# EAGLE design GeigerCounter (EAGLE 6.3)
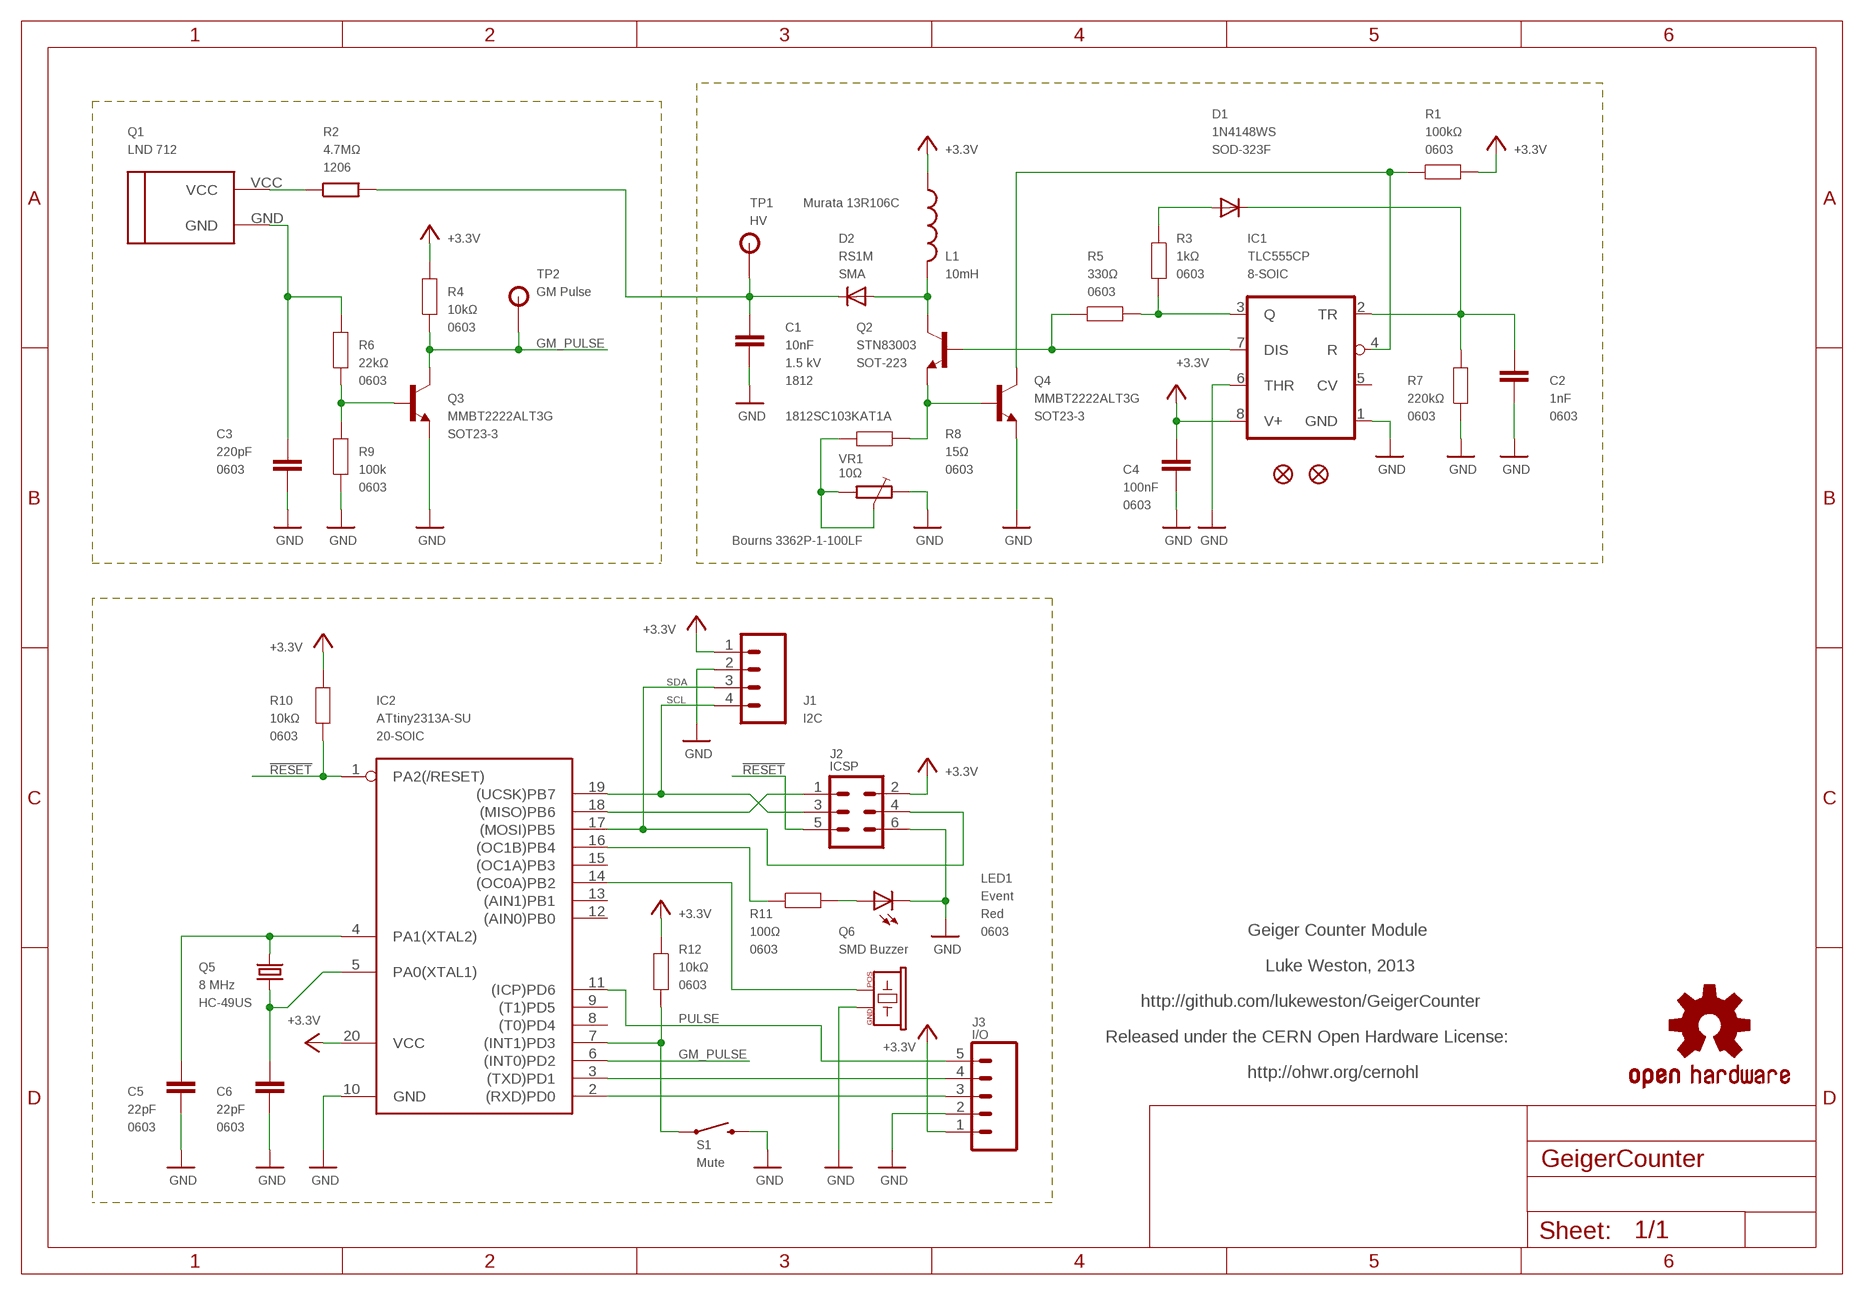
[diagram p0: schematic, sheet 1]

## Parts
C1  10nF  C-EUC1812  [C1812]
C2  1nF  CAP0603  [0603]
C3  220pF  CAP0603  [0603]
C4  100nF  CAP0603  [0603]
C5  22pF  CAP0603  [0603]
C6  22pF  CAP0603  [0603]
D1  1N4148WS  DIODESOD  [SOD-323]
D2  RS1M  DIODE-DO214AC  [DO214AC]
IC1  TLC555CP  LM555D  [SO08]
IC2  ATtiny2313A-SU  TINY2313-*S*  [SO20L$]
J1  I2C  M04PTH  [1X04]
J2  ICSP  ICSP-6  [ICSP-6]
J3  I/O  M05PTH  [1X05]
JP1  FIDUCIALUFIDUCIAL  [MICRO-FIDUCIAL]
JP2  FIDUCIALUFIDUCIAL  [MICRO-FIDUCIAL]
L1  10mH  INDUCTOR-5.08  [INDUCTOR-5.08]
LED1  Event  LED0603  [LED-0603]
Q1  LND 712  GEIGER_TUBELND712  [GEIGER_TUBE]
Q2  STN83003  -NPN-SOT223  [SOT223]
Q3  MMBT2222ALT3G  TRANSISTOR_NPNSOT23  [SOT23]
Q4  MMBT2222ALT3G  TRANSISTOR_NPNSOT23  [SOT23]
Q5  8 MHz  CRYSTALHC49US  [HC49US]
Q6  SMD Buzzer  BUZZERSMD12X12  [BUZZER-12X12-SMT]
R1  100kΩ  RESISTOR0603  [0603]
R2  4.7MΩ  R-EU_R1206  [R1206]
R3  1kΩ  RESISTOR0603  [0603]
R4  10kΩ  RESISTOR0603  [0603]
R5  330Ω  RESISTOR0603  [0603]
R6  22kΩ  RESISTOR0603  [0603]
R7  220kΩ  RESISTOR0603  [0603]
R8  15Ω  RESISTOR0603  [0603]
R9  100k  RESISTOR0603  [0603]
R10  10kΩ  RESISTOR0603  [0603]
R11  100Ω  RESISTOR0603  [0603]
R12  10kΩ  RESISTOR0603  [0603]
S1  Mute  SWITCH-MOMENTARY-2SMD  [TACTILE_SWITCH_SMD]
SY  OSHW-LOGOS  [OSHW-LOGO-S]
TP1  HV  TPPTH  [TP_PTH]
TP2  GM Pulse  TPPTH  [TP_PTH]
VR1  10Ω  TRIM_EU-CT6  [CT6]

## Nets
!RESET: IC2.1(PA2(/RESET)) J2.5 R10.1
+3V3: C4.1 IC1.8(V+) IC2.20(VCC) J1.1 J2.2 J3.1 L1.1 R1.1 R4.2 R10.2 R12.1 ; supply symbol labelled +3.3V
GM_PULSE: IC2.6((INT0)PD2) Q3.3(C) R4.1 TP2.P$1(TP)
GND: C1.2 C2.2 C3.2 C4.2 C5.2 C6.2 IC1.1(GND) IC1.6(THR) IC2.10(GND) J1.2 J2.6 J3.2 LED1.C Q3.2(E) Q4.2(E) Q6.1(GND) R7.1 R9.1 S1.3 VR1.E
MUTE1: IC2.7((INT1)PD3) R12.2 S1.1
N$1: Q1.VCC R2.1
N$14: IC1.7(DIS) Q2.1(B) R5.2
N$15: IC1.4(R) Q4.3(C) R1.2
N$26: IC2.2((RXD)PD0) J3.3
N$27: IC2.3((TXD)PD1) J3.4
N$28: C6.1 IC2.5(PA0(XTAL1)) Q5.1
N$29: C5.1 IC2.4(PA1(XTAL2)) Q5.2
N$31: IC2.18((MISO)PB6) J2.1
N$33: IC2.16((OC1B)PB4) R11.2
N$34: LED1.A R11.1
N$35: IC2.14((OC0A)PB2) Q6.2(POS)
N$39: IC1.3(Q) R3.2 R5.1
N$48: C3.1 Q1.GND R6.2
N$49: Q3.1(B) R6.1 R9.2
N$50: C2.1 D1.1(C) IC1.2(TR) R7.2
N$54: D1.2(A) R3.1
N$55: Q2.3(E) Q4.1(B) R8.2
N$56: R8.1 VR1.A VR1.S
N$57: D2.A L1.2 Q2.4(C)
N$58: C1.1 D2.C R2.2 TP1.P$1(TP)
PULSE: IC2.11((ICP)PD6) J3.5
SCL: IC2.19((UCSK)PB7) J1.4 J2.3
SDA: IC2.17((MOSI)PB5) J1.3 J2.4
Unconnected: IC1.5(CV) IC2.8((T0)PD4) IC2.9((T1)PD5) IC2.12((AIN0)PB0) IC2.13((AIN1)PB1) IC2.15((OC1A)PB3)

## Notes on the sheet
- Geiger Counter Module
- Luke Weston, 2013
- http://github.com/lukeweston/GeigerCounter
- Released under the CERN Open Hardware License:
- http://ohwr.org/cernohl

## Library data of the parts
C1 = rcl:C-EU: CAPACITOR, European symbol; ID: 1812SC103KAT1A; PACKAGE: 1812; VOLTAGE: 1.5 kV
C2-C6 = freetronics-master-v1:CAP: Capacitor Standard 0603 ceramic capacitor, and 0.1" leaded capacitor.; PACKAGE: 0603
D1 = SparkFun:DIODE: Diode These are standard reverse protection diodes and small signal diodes. SMA package can handle up to about 1A. SOD-323 can handle about 200mA. What the SOD-323 package when ordering, there are some mfgs out there that are 5-pin packages.; PACKAGE: SOD-323F
D2 = diode:DIODE-: DIODE; PACKAGE: SMA
IC1 = linear:*555: TIMER; PACKAGE: 8-SOIC
IC2 = avr-6:TINY2313*: Atmel Tiny2313 2K Flash, 128 bytes EEPROM, 128 bytes RAM; PACKAGE: 20-SOIC
J1 = freetronics-master-v1:M04: Header 4 Standard 4-pin 0.1" header. Use with straight break away headers (SKU : PRT-00116), right angle break away headers (PRT-00553), swiss pins (PRT-00743), machine pins (PRT-00117), and female headers (PRT-00115). Molex polarized connector foot print use with SKU : PRT-08231 with associated crimp pins and housings.
J2 = connectors:ICSP-6: PIN HEADER
J3 = freetronics-master-v1:M05: Header 5 Standard 5-pin 0.1" header. Use with straight break away headers (SKU : PRT-00116), right angle break away headers (PRT-00553), swiss pins (PRT-00743), machine pins (PRT-00117), and female headers (PRT-00115). Molex polarized connector foot print use with SKU : PRT-08230 with associated crimp pins and housings.
JP1 JP2 = SparkFun:FIDUCIAL: Fiducial Alignment Points Various fiducial points for machine vision alignment.
L1 = Luke:INDUCTOR-5.08; ID: Murata 13R106C
LED1 = freetronics-master-v1:LED: LEDs Standard schematic elements and footprints for 5mm, 3mm, 1206, and 0603 sized LEDs. 5mm - Spark Fun Electronics SKU : COM-00529 (and others); COLOR: Red; PACKAGE: 0603
Q1 = SparkFun:GEIGER_TUBE: LND712 Geiger Tube
Q2 = transistor-neu-to92:*-NPN-: NPN Transistror; PACKAGE: SOT-223
Q3 Q4 = SparkFun:TRANSISTOR_NPN: Transistor NPN BJT configuration in SOT23 package. MMBT2222 is the common NPN we use. Double check BCE configuration again layout.; PACKAGE: SOT23-3
Q5 = freetronics-master-v1:CRYSTAL: Crystals Various standard crystals. Proven footprints. Spark Fun Electronics SKU : COM-00534; PACKAGE: HC-49US
Q6 = freetronics-master-v1:BUZZER: Buzzer - Piezo Transducer
R1 R3-R12 = freetronics-master-v1:RESISTOR: Resistor Basic schematic elements and footprints for 0603, 1206, and PTH 1/10th watt (small) resistors.; PACKAGE: 0603
R2 = rcl:R-EU_: RESISTOR, European symbol; PACKAGE: 1206
S1 = SparkFun:SWITCH-MOMENTARY-2
SY = SparkFun:OSHW-LOGO: Open Source Hardware Logo This logo indicates the piece of hardware it is found on incorporates a OSHW license and/or adheres to the definition of open source hardware found here: http://freedomdefined.org/OSHW
TP1 TP2 = connectors:TP: Test Point JSK 1/14/11
VR1 = pot:TRIM_EU-: POTENTIOMETER; ID: Bourns 3362P-1-100LF

## Board
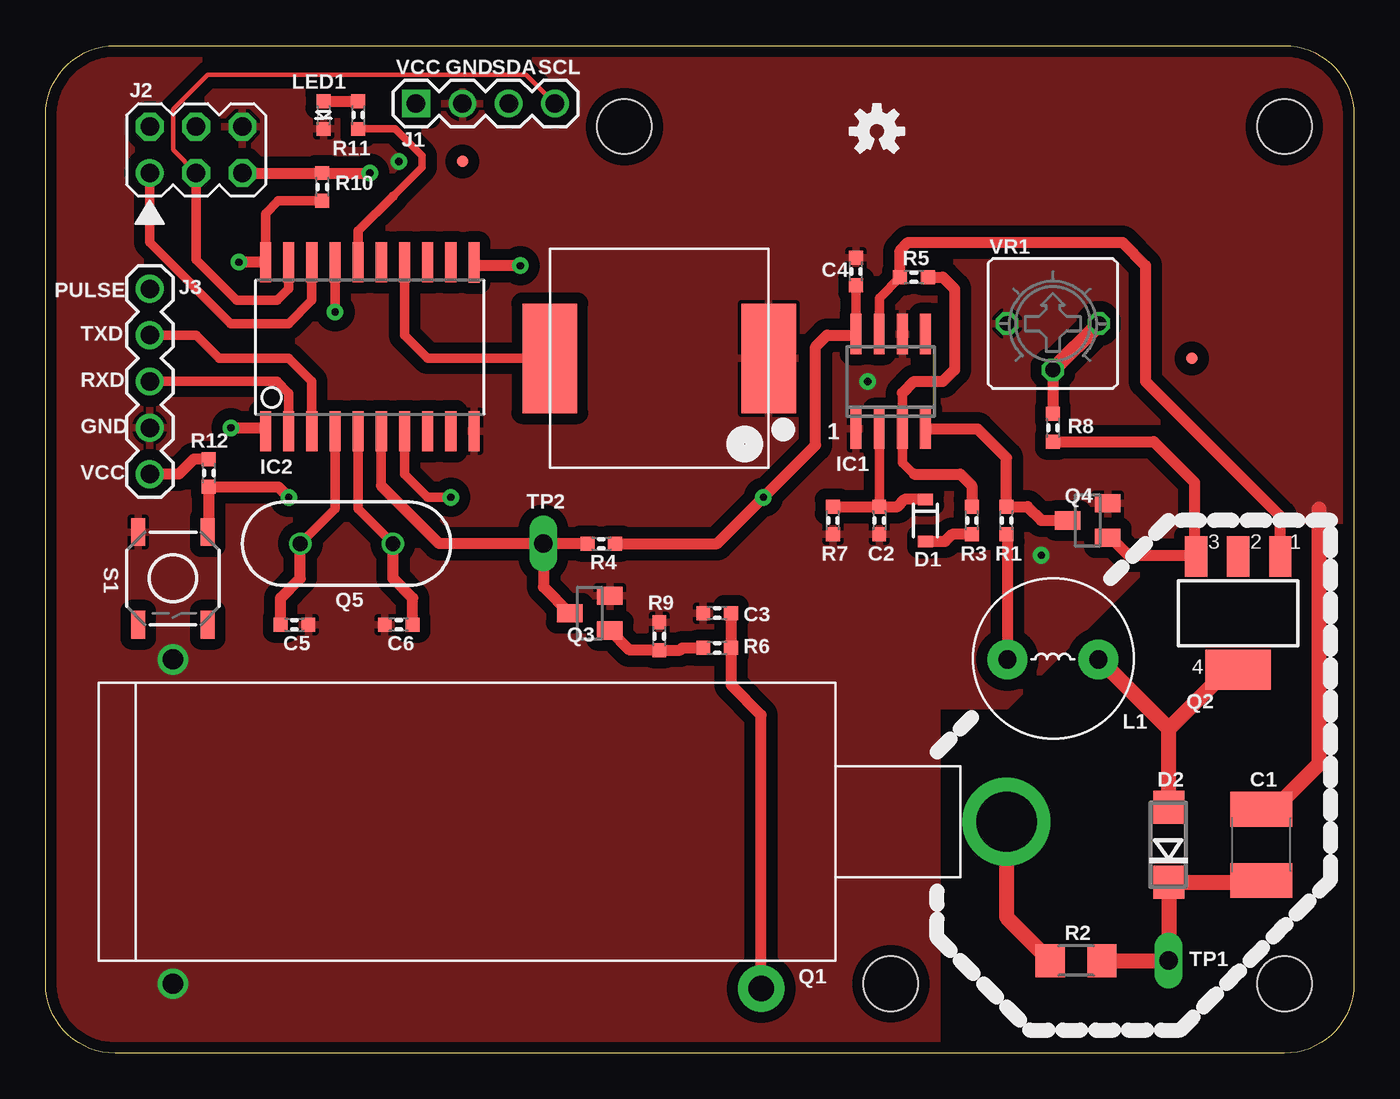
[diagram p1: board, top side]
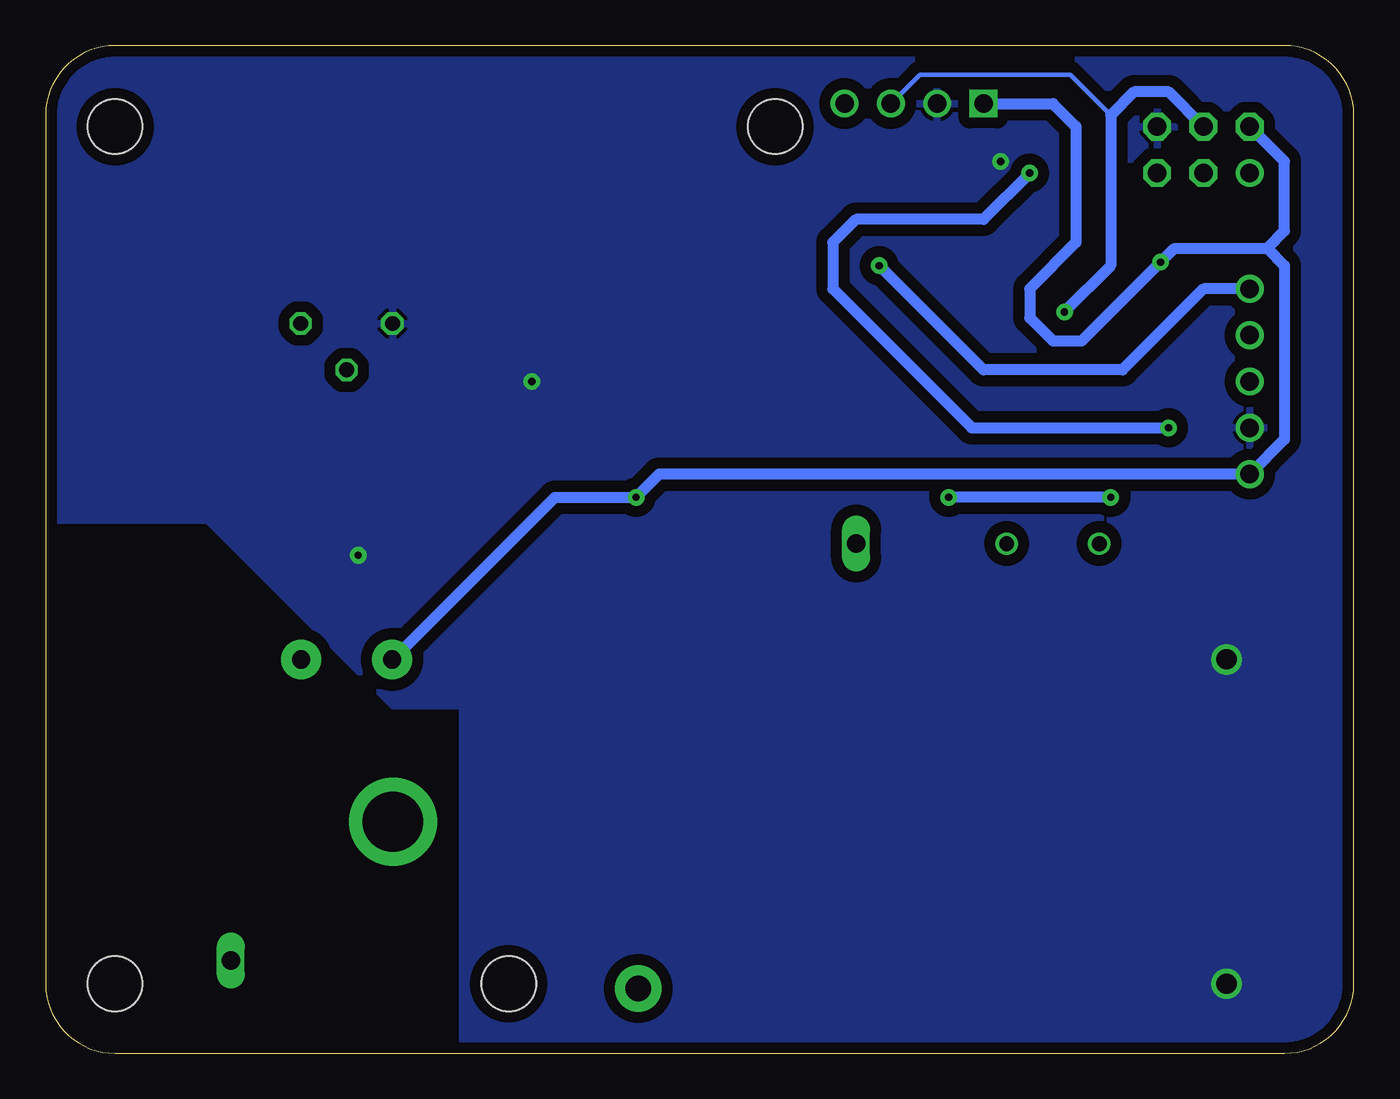
[diagram p2: board, bottom side, seen from below]

Size 71.76 x 55.24 mm. Coordinates in mm from the lower left corner, seen from the top.
Outline: 0,3.81 0,51.43 arc-90 3.81,55.24 67.95,55.24 arc-90 71.76,51.43 71.76,3.81 arc-90 67.95,0 3.81,0 arc-90 0,3.81
Copper layers (1*16): Top 0.035mm / dielectric 1.5mm / Bottom 0.035mm
Design rules "PCBCart-Standard *": minimum track width 8mil, minimum drill 0.4mm, track to track 8mil, track to pad 8mil, pad to pad 8mil, via to via 8mil, smd to smd 8mil, copper to edge 20mil, drill to drill 8mil, minimum pad ring 8mil, minimum via ring 10mil, stop-mask expansion 3mil, vias tented up to drill 16mil, thermal gap 8mil
Holes 3 mm at 46.35,3.81 31.75,50.8 67.95,50.8 67.95,3.81

### Footprints (pad centres in the part's own frame; a part is rotated, then mirrored left to right if it is on the bottom)
C1812 = smd 1.9 x 3.4: 1 -1.95,0; 2 1.95,0
0603 = smd 0.762 x 0.762: 1 -0.762,0; 2 0.762,0
SOD-323 = smd 0.63 x 0.83: 1 -1.15,0; 2 1.15,0
DO214AC = smd 1.8 x 1.7: A 2.05,0; C -2.05,0
SO08 = smd 0.6 x 2.2: 1 -1.905,-2.6; 2 -0.635,-2.6; 3 0.635,-2.6; 4 1.905,-2.6; 5 1.905,2.6; 6 0.635,2.6; 7 -0.635,2.6; 8 -1.905,2.6
SO20L$ = smd 0.61 x 2.21: 1 -5.715,-4.636; 2 -4.445,-4.636; 3 -3.175,-4.636; 4 -1.905,-4.636; 5 -0.635,-4.636; 6 0.635,-4.636; 7 1.905,-4.636; 8 3.175,-4.636; 9 4.445,-4.636; 10 5.715,-4.636; 11 5.715,4.61; 12 4.445,4.636; 13 3.175,4.636; 14 1.905,4.636; 15 0.635,4.636; 16 -0.635,4.636; 17 -1.905,4.636; 18 -3.175,4.636; 19 -4.445,4.636; 20 -5.715,4.636
1X04 = drill 1.016 square: 1 0,0 | drill 1.016: 2 2.54,0; 3 5.08,0; 4 7.62,0
ICSP-6 = drill 1.016: 1 -2.54,-1.27 | drill 1.016 octagon: 2 -2.54,1.27; 3 0,-1.27; 4 0,1.27; 5 2.54,-1.27; 6 2.54,1.27
1X05 = drill 1.016: 1 0,0; 2 2.54,0; 3 5.08,0; 4 7.62,0; 5 10.16,0
MICRO-FIDUCIAL = smd 0.635 x 0.635: 1 0,0
INDUCTOR-5.08 = drill 1 pad 2.184: 1 -2.5,0; 2 2.5,0
LED-0603 = smd 0.762 x 0.762: A -0.762,0; C 0.762,0
GEIGER_TUBE = drill 1.4 pad 2.54: GND 13.462,9.144 | drill 3.302 pad 4.826: VCC 0,0
SOT223 = smd 1.219 x 2.235: 1 -2.311,-3.099; 2 0,-3.099; 3 2.311,-3.099 | smd 3.6 x 2.2: 4 0,3.099
SOT23 = smd 1 x 1.4: 1 -0.95,-1.1; 2 0.95,-1.1; 3 0,1.1
HC49US = drill 0.813: 1 -2.54,0; 2 2.54,0
BUZZER-12X12-SMT = smd 3 x 6: 1 -6,0; 2 6,0
R1206 = smd 1.6 x 1.803: 1 -1.422,0; 2 1.422,0
TACTILE_SWITCH_SMD = smd 1.524 x 0.762: 1 -2.54,1.905; 2 2.54,1.905; 3 -2.54,-1.905; 4 2.54,-1.905
TP_PTH = drill 1.016 long: P$1 0,0
CT6 = drill 0.813 octagon: A 2.515,0; E -2.515,0; S 0,-2.54

### Placement (x,y rotation side)
C1  66.68,11.43 90 top
C2  45.72,29.21 270 top
C3  36.83,24.13 180 top
C4  44.45,42.86 90 top
C5  13.65,23.5 0 top
C6  19.37,23.5 180 top
D1  48.26,29.21 270 top
D2  61.59,11.43 90 top
IC1  46.35,36.83 0 top
IC2  17.78,38.73 0 top
J1  20.32,52.07 0 top
J2  8.26,49.53 0 top
J3  5.71,31.75 90 top
JP1  62.86,38.1 0 top
JP2  22.86,48.89 0 top
L1  55.24,21.59 0 top
LED1  15.24,51.43 270 top
Q1  52.7,12.7 180 top
Q2  65.41,24.13 180 top
Q3  29.85,24.13 90 top
Q4  57.15,29.21 90 top
Q5  16.51,27.94 180 top
Q6  33.66,38.1 180 top
R1  52.7,29.21 90 top
R2  56.52,5.08 0 top
R3  50.8,29.21 90 top
R4  30.48,27.94 0 top
R5  47.62,42.54 180 top
R6  36.83,22.23 0 top
R7  43.18,29.21 90 top
R8  55.24,34.29 270 top
R9  33.66,22.86 270 top
R10  15.18,47.5 270 top
R11  17.15,51.43 270 top
R12  8.95,31.81 270 top
S1  6.98,26.04 270 top
SY  45.59,50.55 0 top
TP1  61.59,5.08 90 top
TP2  27.31,27.94 90 top
VR1  55.24,40 0 top

### Tracks (layer width: path | path; a pad name or v marks a point on that pad's centre or on a via)
!RESET  (via drill 0.4)
  Top 0.406: 11.87,34.29 IC2.1
  Top 0.61: v17.78,48.26 R10.1 J2.5 | v10.16,34.29 11.87,34.29
  Bottom 0.61: v10.16,34.29 20.96,34.29 28.58,41.91 28.58,44.45 27.31,45.72 20.32,45.72 v17.78,48.26
+3V3  (via drill 0.4)
  Top 0.406: 52.74,28.41 R1.1 | 44.39,39.37 IC1.8
  Top 0.508: C4.1 IC1.8 | R10.2 12.76,46.74 12.06,46.04 IC2.20
  Top 0.61: R12.1 8.13,32.58 7.3,31.75 J3.1 | 44.39,39.37 42.86,39.37 42.23,38.73 42.23,33.34 v39.37,30.48 36.83,27.94 R4.2 | IC2.20 v10.61,43.37 | 52.74,28.41 L1.1
  Bottom 0.406: 51.43,22.86 51.48,22.86
  Bottom 0.61: J2.2 3.81,48.89 3.81,45.08 4.76,44.13 | 4.76,44.13 9.84,44.13 v10.61,43.37 14.92,39.05 16.51,39.05 17.78,40.32 17.78,41.91 15.24,44.45 15.24,50.8 16.51,52.07 J1.1 | 4.76,44.13 3.81,43.18 3.81,33.65 J3.1 38.1,31.75 v39.37,30.48 43.81,30.48 51.43,22.86 52.7,21.59 L1.1
GM_PULSE
  Top 0.508: IC2.6 18.42,31.11
  Top 0.61: TP2.P$1 27.31,25.57 Q3.3 | R4.1 TP2.P$1 | 18.42,31.11 21.59,27.94 TP2.P$1
GND  (via drill 0.4, 1.1)
  Top 0.813: C1.2 67.36,13.38 69.85,15.88 69.85,29.84
  other vias: 45.09,36.83 54.61,27.3 19.37,48.89 6.98,21.59 6.98,3.81
  pour Top (isolate 0.61): -0.64,55.88 72.39,55.88 72.39,29.21 62.86,29.21 52.7,19.05 48.89,19.05 48.89,-0.64 -0.64,-0.64
  pour Bottom (isolate 0.61): -0.64,55.88 72.39,55.88 72.39,29.21 62.86,29.21 52.7,19.05 48.89,19.05 48.89,-0.64 -0.64,-0.64
MUTE1  (via drill 0.4)
  Top 0.406: 8.95,28.64 S1.1
  Top 0.508: IC2.7 19.69,31.75 20.96,30.48 v22.23,30.48
  Top 0.61: 8.95,28.64 R12.2 12.76,31.05 v13.33,30.48
  Bottom 0.61: v13.33,30.48 v22.23,30.48
N$1
  Top 0.813: Q1.VCC 52.7,7.47 R2.1
N$14
  Top 0.508: IC1.7 45.72,41.4 R5.2
  Top 0.61: R5.2 46.86,44.01 47.31,44.45 59.05,44.45 60.32,43.18 60.32,36.83 67.72,29.44 Q2.1
N$15
  Top 0.61: IC1.4 51.12,34.23 52.7,32.64 R1.2 53.85,29.97 54.61,29.21 Q4.3
N$26
  Top 0.508: IC2.2 13.33,36.2 12.7,36.83 J3.3
N$27
  Top 0.508: IC2.3 14.61,36.83 13.33,38.1 9.53,38.1 8.26,39.37 J3.4
N$28
  Top 0.508: IC2.5 17.15,29.84 Q5.1
  Top 0.61: C6.1 20.13,24.96 19.05,26.04 Q5.1
N$29
  Top 0.508: IC2.4 15.88,29.84 Q5.2
  Top 0.61: C5.1 12.89,24.96 13.97,26.04 Q5.2
N$31
  Top 0.508: IC2.18 14.61,41.27 13.33,40 10.16,40 5.71,44.45 J2.1
N$33
  Top 0.406: R11.2 19.18,50.67 20.64,49.21 20.64,48.58 19.05,46.99
  Top 0.508: 19.05,46.99 17.15,45.08 IC2.16
N$34
  Top 0.61: LED1.A R11.1
N$35
  Top 0.508: Q6.2 20.96,38.1 19.69,39.37 IC2.14
N$39
  Top 0.508: 47.62,31.75 46.99,32.38 IC1.3 46.99,36.2
  Top 0.61: 47.62,31.75 50.16,31.75 50.8,31.11 R3.2 | 46.99,36.2 47.62,36.83 49.21,36.83 49.85,37.46 49.85,41.91 49.21,42.54 R5.1
N$48
  Top 0.61: C3.1 R6.2 37.59,20.19 39.24,18.54 Q1.GND
N$49
  Top 0.61: Q3.1 32.03,22.1 R9.2 34.8,22.1 34.92,22.23 R6.1
N$50
  Top 0.508: IC1.2 C2.1
  Top 0.61: D1.1 47.11,30.36 46.72,29.97 C2.1 R7.2
N$54
  Top 0.61: D1.2 49.33,28.06 49.72,28.45 R3.1
N$55
  Top 0.406: Q4.1 58.42,28.26 | 63.02,27.3 Q2.3
  Top 0.61: 58.42,28.26 59.37,27.3 63.02,27.3 63.02,31.28 60.77,33.53 R8.2
N$56
  Top 0.61: VR1.S R8.1
  Top 0.813: VR1.A 57.76,39.98 VR1.S
N$57
  Top 0.406: 65.41,20.96 Q2.4 65.41,21.59
  Top 0.813: D2.A 61.59,17.78 | 61.59,17.78 65.41,21.59 | L1.2 57.78,21.59 61.59,17.78
N$58
  Top 0.406: 66.58,9.38 C1.1
  Top 0.813: R2.2 TP1.P$1 D2.C 66.58,9.38
PULSE  (via drill 0.4)
  Top 0.406: 23.66,43.18 IC2.11
  Top 0.61: v26.04,43.18 23.66,43.18
  Bottom 0.61: J3.5 8.26,41.91 12.7,37.46 20.32,37.46 v26.04,43.18
SCL
  Top 0.254: J2.3 6.98,49.53 6.98,51.75 8.89,53.66 26.35,53.66 J1.4
  Top 0.508: IC2.19 13.33,41.91 12.7,41.27 10.48,41.27 8.26,43.5 J2.3
SDA  (via drill 0.4)
  Top 0.508: v15.88,40.64 IC2.17
  Bottom 0.254: 13.33,51.43 15.56,53.66 23.81,53.66 J1.3
  Bottom 0.61: J2.4 10.16,52.7 12.06,52.7 13.33,51.43 13.33,43.18 v15.88,40.64

### Text on the board
tPlace: VCC | GND | SDA | SCL | PULSE | TXD | RXD | GND | 1 | VCC